# EAGLE design digital_supply (EAGLE 6.1)
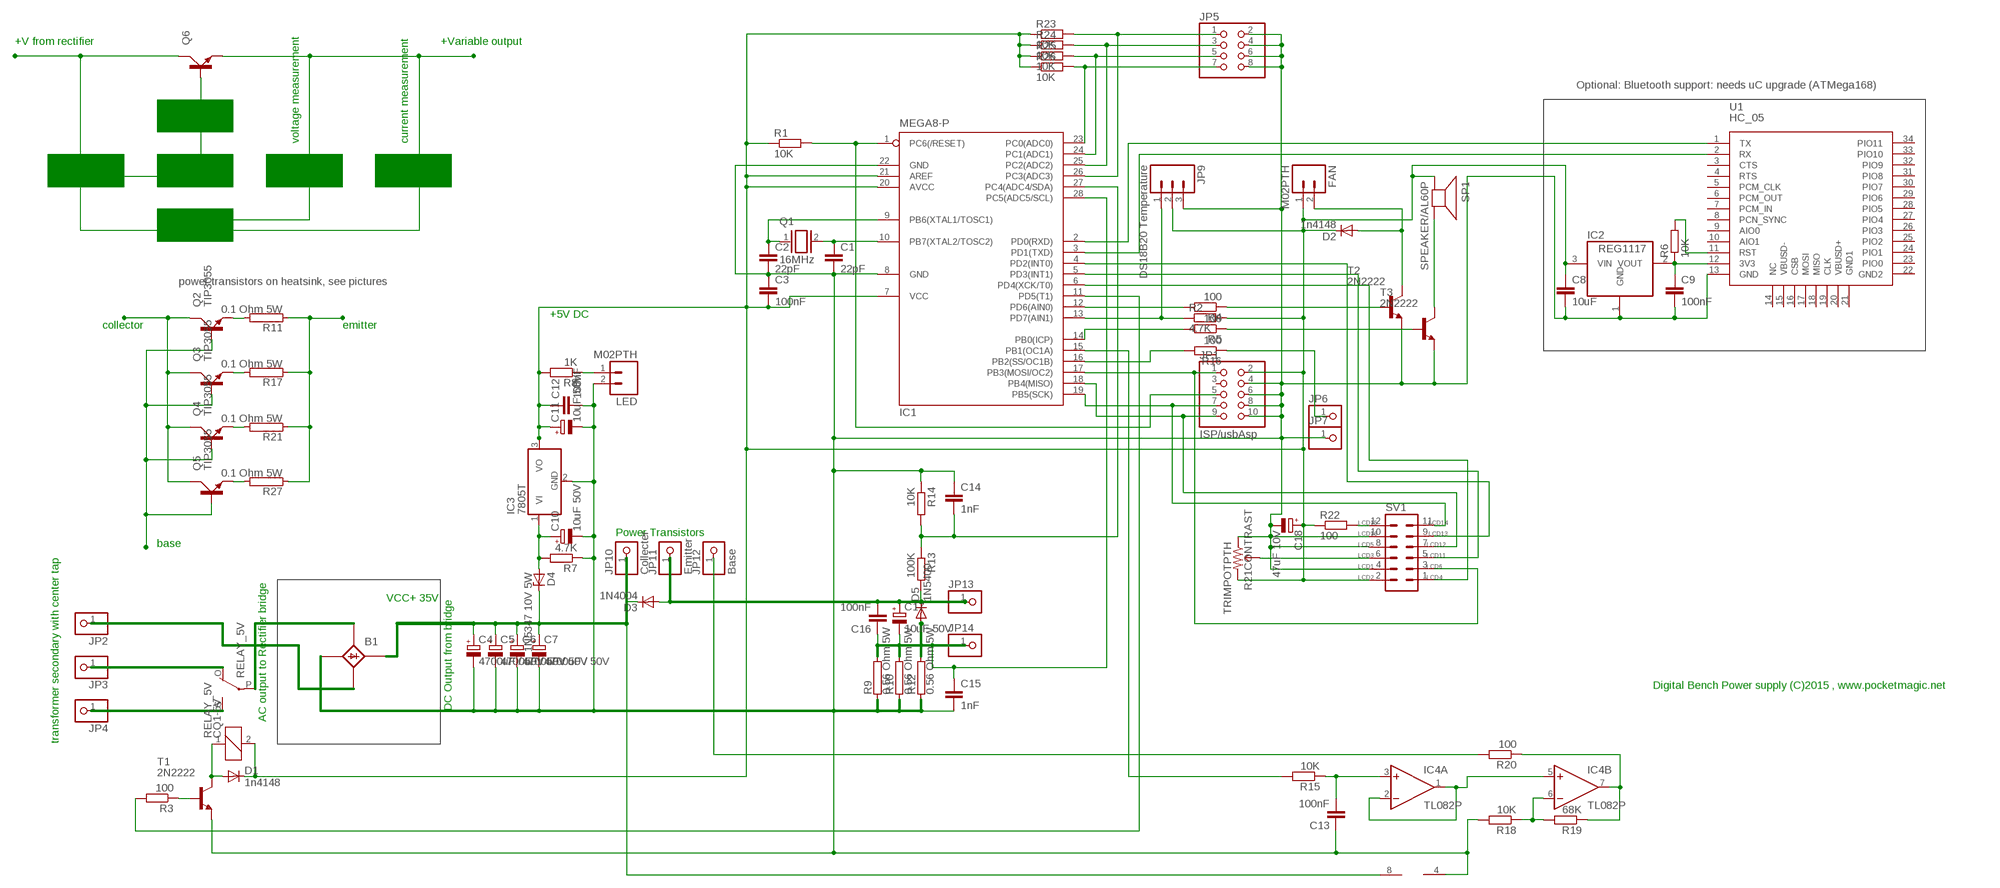
[diagram p0: schematic, sheet 1]

## Parts
B1  B25A-  [B25A-]
C1  22pF  C-EU025-024X044  [C025-024X044]
C2  22pF  C-EU025-024X044  [C025-024X044]
C3  100nF  C-EU025-024X044  [C025-024X044]
C4  4700uF / 50V  CPOL-EUE7.5-18  [E7,5-18]
C5  4700uF / 50V  CPOL-EUE7.5-18  [E7,5-18]
C6  4700uF / 50V  CPOL-EUE7.5-18  [E7,5-18]
C7  4700uF / 50V  CPOL-EUE7.5-18  [E7,5-18]
C8  10uF  C-EUC0805  [C0805]
C9  100nF  C-EUC0805  [C0805]
C10  10uF 50V  CPOL-EUE2-5  [E2-5]
C11  10uF 50V  CPOL-EUE2-5  [E2-5]
C12  100nF  C-EU025-024X044  [C025-024X044]
C13  100nF  C-EU025-024X044  [C025-024X044]
C14  1nF  C-EU025-024X044  [C025-024X044]
C15  1nF  C-EU025-024X044  [C025-024X044]
C16  100nF  C-EU025-024X044  [C025-024X044]
C17  10uF 50V  CPOL-EUE2-5  [E2-5]
C18  47uF 10V  CPOL-EUE2-5  [E2-5]
D1  1n4148  DIODE-D-5  [D-5]
D2  1n4148  DIODE-D-5  [D-5]
D3  1N4004  [DO41-10]
D4  1N5347 10V 5W  ZENER-DIODEDO34-7  [DO34Z7]
D5  1N5400  [DO201-15]
FAN  M02PTH  [1X02]
IC1  MEGA8-P  [DIL28-3]
IC2  REG1117  [SOT223]
IC3  7805T  [TO220H]
IC4  TL082P  [DIL08]
JP1  ISP/usbAsp  PINHD-2X5  [2X05]
JP2  PINHD-1X1  [1X01]
JP3  PINHD-1X1  [1X01]
JP4  PINHD-1X1  [1X01]
JP5  PINHD-2X4  [2X04]
JP6  PINHD-1X1  [1X01]
JP7  PINHD-1X1  [1X01]
JP9  DS18B20 Temperature  M03PTH  [1X03]
JP10  Collecter  PINHD-1X1  [1X01]
JP11  Emitter  PINHD-1X1  [1X01]
JP12  Base  PINHD-1X1  [1X01]
JP13  PINHD-1X1  [1X01]
JP14  PINHD-1X1  [1X01]
LED  M02PTH  [1X02]
Q1  16MHz  XTAL/S  [QS]
Q2  TIP3055  [TOP3AV]
Q3  TIP3055  [TOP3AV]
Q4  TIP3055  [TOP3AV]
Q5  TIP3055  [TOP3AV]
Q6  TIP3055  [TOP3AV]
R1  10K  R-EU_0204/7  [0204/7]
R2  4.7K  R-EU_0204/7  [0204/7]
R3  100  R-EU_0204/7  [0204/7]
R4  100  R-EU_0204/7  [0204/7]
R5  100  R-EU_0204/7  [0204/7]
R6  10K  R-EU_M0805  [M0805]
R7  4.7K  R-EU_0204/7  [0204/7]
R8  1K  R-EU_0204/7  [0204/7]
R9  0.56 Ohm 5W  RAC05  [AC05]
R10  0.56 Ohm 5W  RAC05  [AC05]
R11  0.1 Ohm 5W  RAC05  [AC05]
R12  0.56 Ohm 5W  RAC05  [AC05]
R13  100K  R-EU_0204/7  [0204/7]
R14  10K  R-EU_0204/7  [0204/7]
R15  10K  R-EU_0204/7  [0204/7]
R16  100  R-EU_0204/7  [0204/7]
R17  0.1 Ohm 5W  RAC05  [AC05]
R18  10K  R-EU_0204/7  [0204/7]
R19  68K  R-EU_0204/7  [0204/7]
R20  100  R-EU_0204/7  [0204/7]
R21  0.1 Ohm 5W  RAC05  [AC05]
R21CONTRAST  TRIMPOTPTH  [TRIM_POT_PTH]
R22  100  R-EU_0204/7  [0204/7]
R23  10K  R-EU_0204/7  [0204/7]
R24  10K  R-EU_0204/7  [0204/7]
R25  10K  R-EU_0204/7  [0204/7]
R26  10K  R-EU_0204/7  [0204/7]
R27  0.1 Ohm 5W  RAC05  [AC05]
RELAY_5V  CQ1-5V  G5LE  [G5LE]
SP1  SPEAKER/AL60P  [AL60P]
SV1  MA06-2  [MA06-2]
T1  2N2222  [TO92-EBC-OVAL]
T2  2N2222  [TO92-EBC-OVAL]
T3  2N2222  [TO92-EBC-OVAL]
U1  HC_05  [BLUETOOTH_SMD]

## Nets
N$1: C1.1 IC1.10(PB7(XTAL2/TOSC2)) Q1.2
N$2: C2.1 IC1.9(PB6(XTAL1/TOSC1)) Q1.1
N$3: B1.-1(-) C1.2 C2.2 C3.1 C4.- C5.- C6.- C7.- C8.2 C9.2 C10.- C11.- C12.2 C13.1 C14.1 C15.2 C18.- IC1.8(GND) IC1.22(GND) IC2.1(GND) IC3.2(GND) IC4.4(P:V-) JP1.4 JP1.6 JP1.8 JP1.10 JP5.2 JP5.4 JP5.6 JP5.8 JP7.1 JP9.3 LED.2 R7.1 R9.1 R10.1 R12.1 R14.1 R18.2 R21CONTRAST.1(CCW) SV1.4 SV1.8 SV1.10 T1.E T2.E T3.E U1.13(GND)
N$4: LED.1 R8.1
N$5: IC1.1(PC6(/RESET)) JP1.5 R1.2
N$6: IC1.17(PB3(MOSI/OC2)) JP1.1 SV1.3
N$7: IC1.18(PB4(MISO)) JP1.9 SV1.7
N$8: IC1.4(PD2(INT0)) SV1.9
N$9: IC1.14(PB0(ICP)) R5.2
N$10: IC1.13(PD7(AIN1)) JP9.1 R2.1
N$11: JP3.1 RELAY_5V.O(2:O)
N$12: JP4.1 RELAY_5V.S(2:S)
N$13: B1.AC2-(AC2) JP2.1
N$14: B1.AC1-(AC1) RELAY_5V.P(2:P)
N$15: D1.A RELAY_5V.1 T1.C
N$16: B1.+1(+) C4.+ C5.+ C6.+ C7.+ D3.C D4.C IC4.8(P:V+) JP10.1
N$18: R3.1 T1.B
N$19: IC1.11(PD5(T1)) R3.2
N$20: Q6.C
N$21: Q6.B
N$25: Q6.E
N$26: IC1.12(PD6(AIN0)) R4.2
N$27: C15.1 C16.1 C17.- D5.A IC1.28(PC5(ADC5/SCL)) JP14.1 R9.2 R10.2 R12.2
N$28: IC1.15(PB1(OC1A)) R15.2
N$29: C14.2 IC1.27(PC4(ADC4/SDA)) R13.1 R14.2
N$30: R4.1 T2.B
N$31: D2.A FAN.2 T2.C
N$32: IC1.16(PB2(SS/OC1B)) R16.2
N$33: R5.1 T3.B
N$34: SP1.2(-) T3.C
N$35: C16.2 C17.+ D3.A D5.C JP11.1 JP13.1 R13.2
N$36: IC1.2(PD0(RXD)) U1.1(TX)
N$37: IC1.3(PD1(TXD)) U1.2(RX)
N$38: C9.1 IC2.2(VOUT) R6.1 U1.12(3V3)
N$39: C10.+ D4.A IC3.1(VI) R7.2
N$40: R6.2 U1.11(RST)
N$43: Q2.E R11.2
N$46: JP6.1 R16.1
N$47: C13.2 IC4.3(A:+IN) R15.1
N$48: IC4.1(A:OUT) IC4.2(A:-IN) IC4.5(B:+IN)
N$49: IC4.6(B:-IN) R18.1 R19.2
N$51: IC4.7(B:OUT) R19.1 R20.1
N$52: JP12.1 R20.2
N$54: IC1.6(PD4(XCK/T0)) SV1.1
N$55: IC1.5(PD3(INT1)) SV1.5
N$56: IC1.19(PB5(SCK)) JP1.7 SV1.11
N$57: R21CONTRAST.2(WIPER) SV1.6
N$58: R22.2 SV1.12
N$59: C3.2 C8.1 C11.+ C12.1 C18.+ D1.C D2.C FAN.1 IC1.7(VCC) IC1.20(AVCC) IC1.21(AREF) IC2.3(VIN) IC3.3(VO) JP1.2 JP9.2 R1.1 R2.2 R8.2 R21CONTRAST.3(CW) R22.1 R23.1 R24.1 R25.1 R26.1 RELAY_5V.2 SP1.1(+) SV1.2
N$60: IC1.26(PC3(ADC3)) JP5.1 R23.2
N$61: IC1.25(PC2(ADC2)) JP5.3 R24.2
N$62: IC1.24(PC1(ADC1)) JP5.5 R25.2
N$63: IC1.23(PC0(ADC0)) JP5.7 R26.2
N$64: Q3.E R17.2
N$65: Q4.E R21.2
N$66: Q5.E R27.2
N$67: R11.1 R17.1 R21.1 R27.1
N$68: Q2.C Q3.C Q4.C Q5.C
N$69: Q2.B Q3.B Q4.B Q5.B
Unconnected: B1.+ B1.- B1.AC1 B1.AC2 JP1.3 U1.3(CTS) U1.4(RTS) U1.5(PCM_CLK) U1.6(PCM_OUT) U1.7(PCM_IN) U1.8(PCN_SYNC) U1.9(AIO0) U1.10(AIO1) U1.14(NC) U1.15(VBUSD-) U1.16(CSB) U1.17(MOSI) U1.18(MISO) U1.19(CLK) U1.20(VBUSD+) U1.21(GND1) U1.22(GND2) U1.23(PIO0) U1.24(PIO1) U1.25(PIO2) U1.26(PIO3) U1.27(PIO4) U1.28(PIO5) U1.29(PIO6) U1.30(PIO7) U1.31(PIO8) U1.32(PIO9) U1.33(PIO10) U1.34(PIO11)

## Notes on the sheet
- +V from rectifier | +Variable output
- Optional: Bluetooth support: needs uC upgrade (ATMega168)
- AMPLIFIER
- voltage measurement | current measurement
- control logic
- atmega8 | DAC | DIVIDER | SHUNT
- ADC
- power transistors on heatsink, see pictures
- +5V DC
- collector | emitter
- LCD15                                  LCD14
- Power Transistors | LCD16                                  LCD13
- base | LCD5                                   LCD12
- LCD3                                   LCD11
- LCD1                                   LCD6
- LCD2                                   LCD4
- VCC+ 35V
- Digital Bench Power supply (C)2015 , www.pocketmagic.net
- DC Output from bridge
- AC output to Rectifier bridge
- transformer secondary with center tap

## Library data of the parts
B1 = rectifier:B25A-: RECTIFIER 25-A bridge
C1-C3 C12-C16 = rcl:C-EU: CAPACITOR, European symbol
C4-C7 C10 C11 C17 C18 = rcl:CPOL-EU: POLARIZED CAPACITOR, European symbol
C8 C9 = resistor:C-EU: CAPACITOR, European symbol
D1 D2 = diode:DIODE-: DIODE
D3 = adafruit:1N4004: DIODE General purpose 1N400x type rectifier (With bigger pads) http://www.ladyada.net/library/pcb/eaglelibrary.html
D4 = diode:ZENER-DIODE: Z-Diode
D5 = diode:1N5400: DIODE standard rectifier, 3 A, 50 V (Motorola)
FAN LED = sparkfun-connectors:M02: Standard 2-pin 0.1" header. Use with - straight break away headers ( PRT-00116) - right angle break away headers (PRT-00553) - swiss pins (PRT-00743) - machine pins (PRT-00117) - female headers (PRT-00115) Molex polarized connector foot print use with: PRT-08233 with associated crimp pins and housings. 2.54_SCREWTERM for use with PRT-10571. 3.5mm Screw Terminal footprints for PRT-08084 5mm Screw Terminal footprints for use with PRT-08433
IC1 = atmel:MEGA8-P: MICROCONTROLLER 8 Kbytes FLASH, 1 kbytes SRAM, 512 bytes EEPROM, USART, 4-channel 10 bit ADC, 2-channel 8 bit ADC Pin compatible with Atmega48, ATMega88, ATMega168 Source: avr.lbr; OC_FARNELL: unknown; OC_NEWARK: unknown
IC2 = burr-brown:REG1117: 800mA and 1A Low Dropout (LDO) Positive Regulator 1.8V, 2.5V, 2.85V, 3.3V, 5V, and Adj; MPN: REG1117; OC_FARNELL: 1097566; OC_NEWARK: 14P6981
IC3 = linear:78*: Positive VOLTAGE REGULATOR Source: http://cache.national.com/ds/LM/LM78L05.pdf http://www.fairchildsemi.com/ds/LM/LM7805.pdf
IC4 = linear:TL082: OP AMP
JP1 = pinhead:PINHD-2X5: PIN HEADER
JP2-JP4 JP6 JP7 JP10-JP14 = adafruit:PINHD-1X1: Pin header 1x1 for 0.1" spacing With round pins
JP5 = adafruit:PINHD-2X4: PIN HEADER
JP9 = sparkfun-connectors:M03: Header 3 Standard 3-pin 0.1" header. Use with straight break away headers (SKU : PRT-00116), right angle break away headers (PRT-00553), swiss pins (PRT-00743), machine pins (PRT-00117), and female headers (PRT-00115). Molex polarized connector foot print use with SKU : PRT-08232 with associated crimp pins and housings.
Q1 = special:XTAL/S: CRYSTAL
Q2-Q6 = transistor-power:TIP3055: NPN TRANSISTOR
R1-R8 R13-R16 R18-R20 R22-R26 = rcl:R-EU_: RESISTOR, European symbol
R9-R12 R17 R21 R27 = resistor-power:R: Power Resitor; OC_FARNELL: unknown; OC_NEWARK: unknown
R21CONTRAST = sparkfun-electromechanical:TRIMPOT: Various small potentiometers for "set-and-forget" applications
RELAY_5V = relay:G5LE: RELAY 1 x switch, 10 A/120 V AC, 8 A/30 V DC, Omron; OC_FARNELL: unknown; OC_NEWARK: unknown
SP1 = adafruit:SPEAKER: SPEAKER Source: Buerklin Added PS12 (for part # PS1240 piezo) http://www.ladyada.net/library/pcb/eaglelibrary.html
SV1 = con-lstb:MA06-2: PIN HEADER; OC_FARNELL: unknown; OC_NEWARK: unknown
T1-T3 = adafruit:2N2222: NPN TRANSISTOR Big oval pads
U1 = bluetooth-hc-05:HC_05: HC-05 Bluetooth Module

## Board
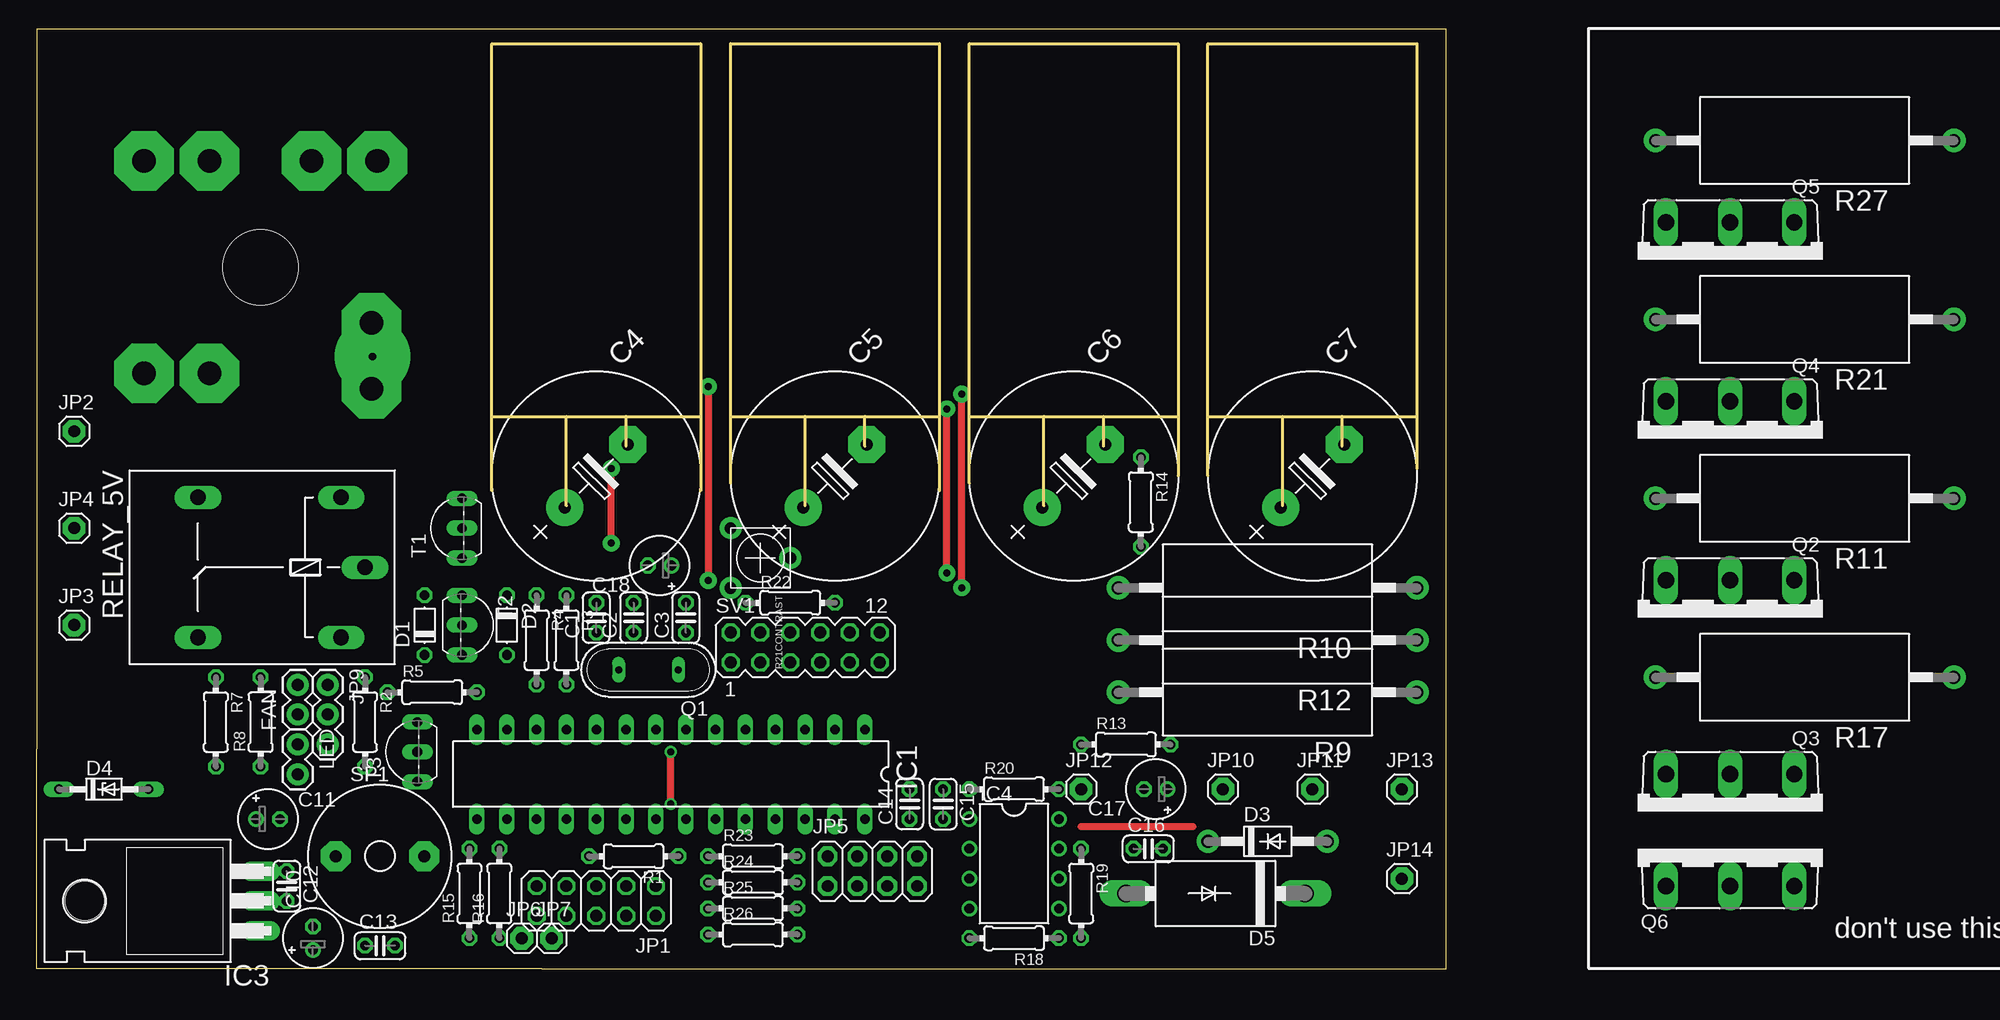
[diagram p1: board, top side]
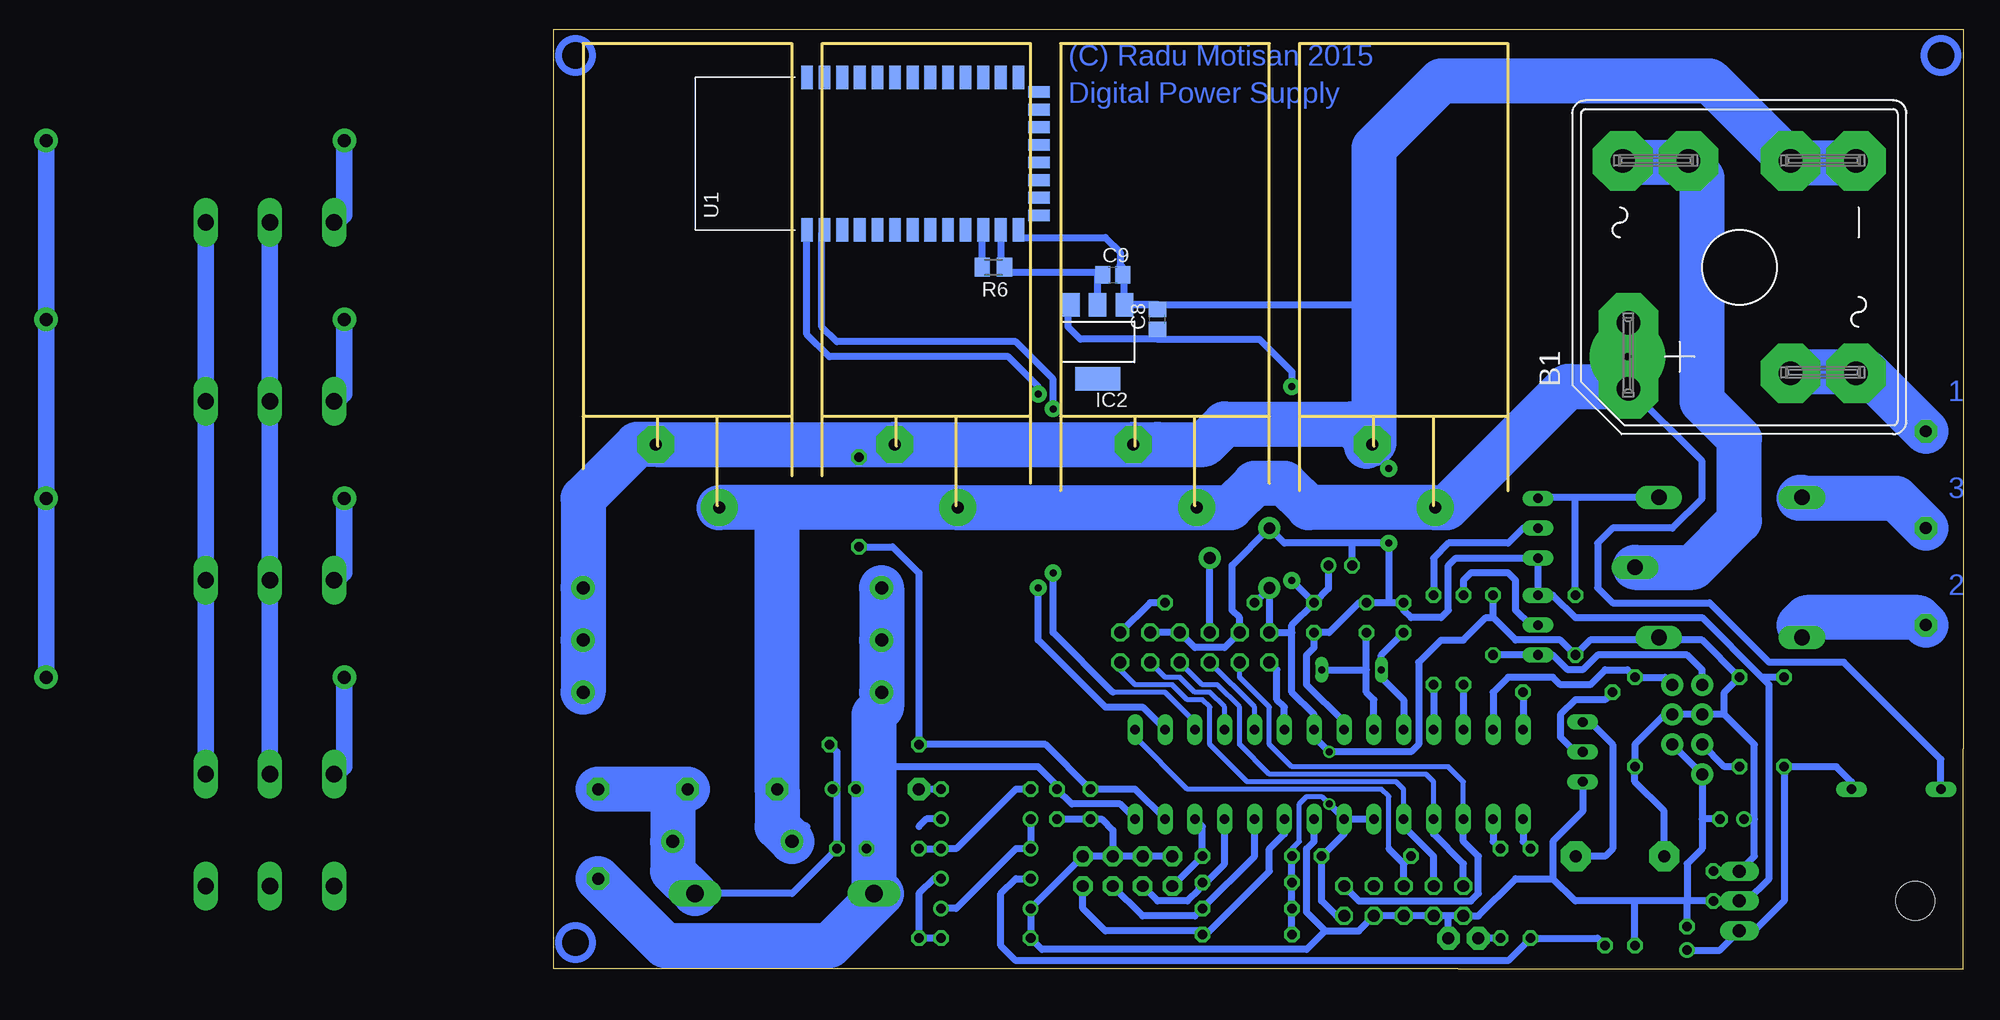
[diagram p2: board, bottom side, seen from below]

Size 120 x 80 mm. Coordinates in mm from the lower left corner, seen from the top.
Outline: 38.73,40.69 38.73,47.04
Outline: 38.73,47.04 38.73,78.79 56.52,78.79 56.52,47.04
Outline: 56.52,47.04 56.52,40.69
Outline: 59.05,41.33 59.05,47.04
Outline: 59.05,47.04 59.05,78.79 76.83,78.79 76.83,47.04
Outline: 76.83,47.04 76.83,40.69
Outline: 79.38,41.33 79.38,47.04
Outline: 79.38,47.04 79.38,78.79 97.16,78.79 97.16,47.04
Outline: 97.16,47.04 97.16,41.96
Outline: 99.69,41.96 99.69,47.04
Outline: 99.69,47.04 99.69,78.79 117.47,78.79 117.47,47.04
Outline: 117.47,47.04 117.47,42.59
Outline: 38.73,47.04 45.09,47.04
Outline: 45.09,47.04 50.16,47.04
Outline: 50.16,47.04 56.52,47.04
Outline: 59.05,47.04 65.41,47.04
Outline: 65.41,47.04 70.48,47.04
Outline: 70.48,47.04 76.83,47.04
Outline: 79.38,47.04 85.72,47.04
Outline: 85.72,47.04 90.81,47.04
Outline: 90.81,47.04 97.16,47.04
Outline: 99.69,47.04 106.05,47.04
Outline: 106.05,47.04 111.12,47.04
Outline: 111.12,47.04 117.47,47.04
Outline: 45.09,39.42 45.09,47.04
Outline: 50.16,44.5 50.16,47.04
Outline: 65.41,39.42 65.41,47.04
Outline: 70.48,44.5 70.48,47.04
Outline: 90.81,44.5 90.81,47.04
Outline: 85.72,39.42 85.72,47.04
Outline: 106.05,39.42 106.05,47.04
Outline: 111.12,44.5 111.12,47.04
Outline: 43,0 120,0 120,80 0,80 0,18.73 0,0 43,0
Copper layers (1*16): Top 0.035mm / dielectric 1.5mm / Bottom 0.035mm
Design rules: minimum track width 10mil, minimum drill 24mil, track to track 8mil, track to pad 8mil, pad to pad 8mil, via to via 8mil, smd to smd 8mil, copper to edge 40mil, drill to drill 8mil, minimum pad ring 10mil, minimum via ring 8mil, stop-mask expansion 4mil, vias tented up to drill 0mil, thermal gap 10mil

### Footprints (pad centres in the part's own frame; a part is rotated, then mirrored left to right if it is on the bottom)
B25A- = drill 2.007 pad 5.08 octagon: + -10.338,9.449; +1 -4.75,9.449; - 9.042,-4.343; -1 9.042,-9.931; AC1 9.042,4.343; AC1- 9.042,9.931; AC2 -9.042,-4.343; AC2- -9.042,-9.931 | hole 6.401: 0,0
C025-024X044 = drill 0.813 octagon: 1 -1.27,0; 2 1.27,0
E7,5-18 = drill 1.016 pad 3.15: + -3.81,0 | drill 1.016 pad 3.15 octagon: - 3.81,0
C0805 = smd 1.3 x 1.5: 1 -0.85,0; 2 0.85,0
E2-5 = drill 0.813 pad 1.27: + -1.016,0 | drill 0.813 pad 1.27 octagon: - 1.016,0
D-5 = drill 0.813 octagon: A 2.54,0; C -2.54,0
DO41-10 = drill 1.118 pad 1.93: A 5.08,0; C -5.08,0
DO34Z7 = drill 0.813 long: A 3.81,0; C -3.81,0
DO201-15 = drill 1.499 long: A 7.62,0; C -7.62,0
1X02 = drill 1.016 pad 1.88: 1 0,0; 2 2.54,0
DIL28-3 = drill 0.813 long: 1 -16.51,-3.81; 2 -13.97,-3.81; 3 -11.43,-3.81; 4 -8.89,-3.81; 5 -6.35,-3.81; 6 -3.81,-3.81; 7 -1.27,-3.81; 8 1.27,-3.81; 9 3.81,-3.81; 10 6.35,-3.81; 11 8.89,-3.81; 12 11.43,-3.81; 13 13.97,-3.81; 14 16.51,-3.81; 15 16.51,3.81; 16 13.97,3.81; 17 11.43,3.81; 18 8.89,3.81; 19 6.35,3.81; 20 3.81,3.81; 21 1.27,3.81; 22 -1.27,3.81; 23 -3.81,3.81; 24 -6.35,3.81; 25 -8.89,3.81; 26 -11.43,3.81; 27 -13.97,3.81; 28 -16.51,3.81
SOT223 = smd 1.499 x 2.007: 1 -2.261,-3.15; 2 0.025,-3.15; 3 2.311,-3.15 | smd 3.81 x 2.007: 4 0,3.15
TO220H = drill 1.118 long: 1 -2.54,-10.16; 2 0,-10.16; 3 2.54,-10.16 | hole 3.302: 0,4.826
DIL08 = drill 0.813 pad 1.27: 1 -3.81,-3.81; 2 -1.27,-3.81; 3 1.27,-3.81; 4 3.81,-3.81; 5 3.81,3.81; 6 1.27,3.81; 7 -1.27,3.81; 8 -3.81,3.81
2X05 = drill 1.016 octagon: 1 -5.08,-1.27; 2 -5.08,1.27; 3 -2.54,-1.27; 4 -2.54,1.27; 5 0,-1.27; 6 0,1.27; 7 2.54,-1.27; 8 2.54,1.27; 9 5.08,-1.27; 10 5.08,1.27
1X01 = drill 1.016 pad 1.93 octagon: 1 0,0
2X04 = drill 1.016 pad 1.676 octagon: 1 -3.81,-1.27; 2 -3.81,1.27; 3 -1.27,-1.27; 4 -1.27,1.27; 5 1.27,-1.27; 6 1.27,1.27; 7 3.81,-1.27; 8 3.81,1.27
1X03 = drill 1.016 pad 1.88: 1 0,0; 2 2.54,0; 3 5.08,0
QS = drill 0.61 long: 1 -2.54,0; 2 2.54,0
TOP3AV = drill 1.397 long: B -5.461,-3.175; C 0,-3.175; E 5.461,-3.175
0204/7 = drill 0.813 octagon: 1 -3.81,0; 2 3.81,0
M0805 = smd 1.3 x 1.6: 1 -0.95,0; 2 0.95,0
AC05 = drill 1.1 pad 2: 1 -12.7,0; 2 12.7,0
TRIM_POT_PTH = drill 1 pad 1.88: 1 -2.54,-2.54; 2 0,2.54; 3 2.54,-2.54
G5LE = drill 1.321 long: 1 -7.493,-5.969; 2 -7.493,5.969; O 4.699,5.969; P -9.525,0; S 4.699,-5.969
AL60P = drill 1.016 pad 2.54 octagon: 1 -3.759,0; 2 3.759,0
MA06-2 = drill 1.016 octagon: 1 -6.35,-1.27; 2 -6.35,1.27; 3 -3.81,-1.27; 4 -3.81,1.27; 5 -1.27,-1.27; 6 -1.27,1.27; 7 1.27,-1.27; 8 1.27,1.27; 9 3.81,-1.27; 10 3.81,1.27; 11 6.35,-1.27; 12 6.35,1.27
TO92-EBC-OVAL = drill 0.813 long: B 0,-1.27; C 2.54,-1.27; E -2.54,-1.27
BLUETOOTH_SMD = smd 2 x 1: 1 -6.35,3.81; 2 -6.35,2.31; 3 -6.35,0.81; 4 -6.35,-0.69; 5 -6.35,-2.19; 6 -6.35,-3.69; 7 -6.35,-5.19; 8 -6.35,-6.69; 9 -6.35,-8.19; 10 -6.35,-9.69; 11 -6.35,-11.19; 12 -6.35,-12.69; 13 -6.35,-14.19; 22 6.65,-14.19; 23 6.65,-12.69; 24 6.65,-11.19; 25 6.65,-9.69; 26 6.65,-8.19; 27 6.65,-6.69; 28 6.65,-5.19; 29 6.65,-3.69; 30 6.65,-2.19; 31 6.65,-0.69; 32 6.65,0.81; 33 6.65,2.31; 34 6.65,3.81 | smd 1 x 1.8: 14 -5.1,-15.94; 15 -3.6,-15.94; 16 -2.1,-15.94; 17 -0.6,-15.94; 18 0.9,-15.94; 19 2.4,-15.94; 20 3.9,-15.94; 21 5.4,-15.94

### Placement (x,y rotation side)
B1  19.05,59.74 90 bottom
C1  47.62,29.9 90 top
C2  50.8,29.9 90 top
C3  55.24,29.9 90 top
C4  47.62,41.96 45 top
C5  67.94,41.96 45 top
C6  88.27,41.96 45 top
C7  108.58,41.96 45 top
C8  68.58,55.3 90 bottom
C9  72.39,59.11 0 bottom
C10  23.5,2.59 90 top
C11  19.68,12.75 0 top
C12  21.27,7.04 270 top
C13  29.21,1.95 0 top
C14  74.3,14.02 90 top
C15  77.15,14.02 270 top
C16  94.61,10.21 0 top
C17  95.25,15.29 180 top
C18  53.02,34.34 180 top
D1  33.02,29.26 90 top
D2  40.01,29.26 270 top
D3  104.78,10.84 0 top
D4  5.71,15.29 0 top
D5  100.33,6.4 180 top
FAN  22.23,21.64 90 top
IC1  53.98,16.56 180 top
IC2  73.66,53.39 180 bottom
IC3  8.89,5.77 90 top
IC4  83.19,8.94 270 top
JP1  47.62,5.77 180 top
JP2  3.17,45.77 0 top
JP3  3.17,29.26 0 top
JP4  3.17,37.52 0 top
JP5  71.12,8.3 0 top
JP6  41.27,2.59 0 top
JP7  43.81,2.59 0 top
JP9  24.77,24.18 270 top
JP10  100.97,15.29 0 top
JP11  108.58,15.29 0 top
JP12  88.9,15.29 0 top
JP13  116.2,15.29 0 top
JP14  116.2,7.67 0 top
LED  22.23,19.1 270 top
Q1  52.07,25.45 180 top
Q2  144.15,29.9 180 top  (outside the outline)
Q3  144.15,13.38 180 top  (outside the outline)
Q4  144.15,45.14 180 top  (outside the outline)
Q5  144.15,60.38 180 top  (outside the outline)
Q6  144.15,10.21 0 top  (outside the outline)
R1  50.8,9.57 180 top
R2  27.94,21.01 270 top
R3  45.09,27.99 270 top
R4  42.55,27.99 270 top
R5  33.66,23.55 0 top
R6  82.55,59.74 180 bottom
R7  15.24,21.01 270 top
R8  19.05,21.01 90 top
R9  104.78,23.55 180 top
R10  104.78,32.44 180 top
R11  150.5,40.05 180 top  (outside the outline)
R12  104.78,27.99 180 top
R13  92.71,19.1 0 top
R14  93.98,39.74 270 top
R15  36.83,6.4 90 top
R16  39.37,6.4 90 top
R17  150.5,24.81 180 top  (outside the outline)
R18  83.19,2.59 180 top
R19  88.9,6.4 270 top
R20  83.19,15.29 0 top
R21  150.5,55.3 180 top  (outside the outline)
R21CONTRAST  61.59,34.98 270 top
R22  64.14,31.16 0 top
R23  60.96,9.57 0 top
R24  60.96,7.35 0 top
R25  60.96,5.13 0 top
R26  60.96,2.91 0 top
R27  150.5,70.53 180 top  (outside the outline)
RELAY_5V  18.41,34.18 180 top
SP1  29.21,9.57 0 top
SV1  65.41,27.35 0 top
T1  34.92,37.52 90 top
T2  37.47,29.26 270 top
T3  31.11,18.47 90 top
U1  94.61,69.27 90 bottom

### Tracks (layer width: path | path; a pad name or v marks a point on that pad's centre or on a via)
N$1
  Bottom 0.61: IC1.10 47.62,22.91 49.53,24.81 Q1.2 49.53,26.72 C1.1
N$2
  Bottom 0.61: IC1.9 50.16,22.91 50.8,23.55 50.8,25.45 | 50.8,25.45 C2.1 | Q1.1 50.8,25.45
N$3  (via drill 0.6 pad 1.42)
  Top 0.61: v48.9,36.24 v48.9,42.59
  Bottom 0.61: 43.81,4.5 JP1.10 41.27,4.5 38.1,7.67 34.92,7.67 | 43.81,4.5 JP1.8 JP1.6 JP1.4 51.44,3.23 54.29,3.23 | 50.8,44.5 50.47,44.5 | 50.47,44.5 50.16,44.5 C4.- 50.47,44.5 | IC2.1 71.4,59.6 | 71.4,59.6 C9.2 | 68.8,44.87 68.58,44.65 | U1.13 80.64,62.92 80.01,62.28 73.03,62.28 71.75,61.01 71.75,59.95 71.4,59.6 | IC2.1 50.8,56.54 50.8,47.04 51.44,46.41 52.07,46.41 | C8.2 68.58,56.56 71.37,56.56 IC2.1 | 48.9,31.16 C1.2 47.62,30.53 46.99,29.9 44.45,29.9 43.81,30.53 43.81,34.34 43.18,34.98 T1.E T2.E 34.92,31.8 33.02,29.9 22.23,29.9 17.14,24.81 | JP9.3 LED.2 22.23,12.75 | IC1.8 52.7,21.01 55.88,24.18 55.88,26.72 55.24,27.35 C3.1 53.98,28.62 51.44,31.16 C2.2 48.9,31.16 | IC1.22 55.24,10.84 55.88,10.21 55.88,4.81 54.29,3.23 | T3.E 32.38,13.38 34.92,10.84 34.92,7.67 | 23.5,5.77 C12.2 IC3.2 18.41,5.77 16.51,7.67 16.51,24.18 17.14,24.81 | 23.5,5.77 27.94,5.77 | 27.94,5.77 33.02,5.77 34.92,7.67 | C13.1 27.94,5.77 | R14.1 92.38,43.23 C6.- | 48.9,31.16 v48.9,36.24 52.07,36.24 | SV1.10 SV1.8 65.41,27.35 62.87,27.35 SV1.4 61.59,29.9 62.23,30.53 62.23,34.34 R21CONTRAST.1 57.78,36.24 52.07,36.24 | v48.9,42.59 50.47,44.5 | JP5.2 JP5.4 JP5.6 | JP5.6 JP5.8 IC4.4 R18.2 78.42,1.64 55.88,1.64 54.29,3.23 | C15.2 C14.1 73.34,12.75 72.39,11.8 JP5.6 | C10.- 23.5,5.77 | C11.- 22.23,12.75 | R7.1 17.14,24.81 | JP7.1 43.81,4.5 | C18.- 52.01,36.18 52.07,36.24 | 22.23,12.75 22.23,10.21 23.5,8.94 23.5,5.77
  Bottom 3.81: 50.16,44.81 C4.- 52.07,46.41 62.87,46.41 64.62,44.65 68.58,44.65 C5.- C6.- C7.- 112.88,44.65 117.47,40.05 R10.1 v117.47,27.99 R9.1 | 50.8,44.5 50.16,45.14 50.16,69.9 44.45,75.61 21.59,75.61 14.61,68.63 9.27,68.63 B1.-1
N$4
  Bottom 0.61: R8.1 20.32,17.2 LED.1
N$5
  Bottom 0.406: 48.9,10.21 48.9,14.66 49.53,15.29 66.04,15.29 70.48,19.73
  Bottom 0.61: 70.48,19.73 IC1.1 | JP1.5 47.62,8.94 | 47.62,8.94 R1.2 | 48.9,10.21 47.62,8.94
N$6
  Bottom 0.406: IC1.17 42.55,15.92 43.81,17.2 57.15,17.2 59.05,19.1 59.05,22.27 61.59,24.81 SV1.3
  Bottom 0.61: JP1.1 51.44,5.77 41.91,5.77 41.27,6.4 41.27,9.57 42.55,10.84 IC1.17
N$7
  Bottom 0.406: IC1.18 45.09,15.92 45.72,16.56 59.05,16.56 61.59,19.1 61.59,22.27 63.5,24.18 64.77,24.18 SV1.7
  Bottom 0.61: JP1.9 42.55,8.94 45.09,11.48 IC1.18
N$8
  Bottom 0.406: IC1.4 62.87,22.27 64.14,23.55 65.41,23.55 66.67,24.81 67.94,24.81 SV1.9
N$9
  Bottom 0.61: R5.2 IC1.14
N$10
  Bottom 0.61: JP9.1 25.4,24.81 R2.1 28.57,25.45 30.48,25.45 31.75,24.18 34.29,24.18 34.92,24.81 38.73,24.81 40.01,23.55 IC1.13 40.01,21.01
N$11
  Bottom 0.61: RELAY_5V.O 13.72,29.01 13.97,29.26
  Bottom 3.81: JP3.1 3.81,29.9 13.34,29.9 13.97,29.26
N$12
  Bottom 3.81: JP4.1 5.71,40.05 13.97,40.05 13.88,40.15 RELAY_5V.S
N$13
  Bottom 3.81: JP2.1 8.26,50.85 9.27,50.85 | 14.61,50.85 9.27,50.85 | 9.27,50.85 B1.AC2-
N$14
  Bottom 3.81: RELAY_5V.P 23.02,34.18 19.05,38.15 19.05,45.14 22.23,48.31 22.23,67.36 23.5,68.63 29.13,68.63 | 29.21,68.63 29.13,68.63 | 29.13,68.63 B1.AC1-
N$15
  Bottom 0.61: RELAY_5V.1 33.02,40.15 | 33.02,40.15 36.1,40.15 T1.C | D1.A 33.02,40.15
N$16  (via drill 0.6 pad 6.45)  (2 unrouted)
  Top 0.61: 88.9,12.11 98.42,12.11
  Bottom 0.61: IC4.8 88.27,12.75 88.9,12.11 | 28.57,49.58 22.23,43.23 22.23,40.05 24.77,37.52 29.84,37.52 31.11,36.24 31.11,32.44 29.84,31.16 21.59,31.16 16.51,26.09 10.16,26.09 1.91,17.83 D4.C | 98.42,12.11 100.33,12.75 100.97,12.11 98.42,12.11
  Bottom 3.81: B1.+1 28.57,54.91 v28.57,52.12 28.57,49.58 33.66,49.58 43.97,39.27 C4.+ 55.73,39.27 57.78,41.33 60.33,41.33 62.38,39.27 C5.+ C6.+ 100.33,39.27 | 100.33,39.27 C7.+ | 100.33,39.27 100.97,38.63 JP10.1 100.97,12.11 D3.C
N$18
  Bottom 0.61: R3.1 45.09,34.98 43.81,36.24 38.73,36.24 37.47,37.52 T1.B
N$19
  Bottom 0.61: R3.2 IC1.11
N$26
  Bottom 0.61: R4.2 IC1.12
N$27  (via drill 0.6 pad 1.42)
  Bottom 0.61: IC1.28 71.75,14.02 75.88,14.02 C15.1 77.15,15.61 78.74,17.2 92.08,17.2 92.71,16.56 93.6,15.67 C17.- | C16.1 92.71,10.21
  Bottom 3.81: JP14.1 110.49,1.95 96.52,1.95 92.08,6.4 D5.A 92.71,10.21 92.71,16.56 92.71,21.64 92.08,22.27 R9.2 R12.2 R10.2
  other vias: 92.08,27.99
N$28
  Bottom 0.61: IC1.15 37.47,10.84 R15.2
N$29
  Bottom 0.61: IC1.27 70.48,15.29 C14.2 78.11,19.1 R13.1 88.9,33.7 91.12,35.93 R14.2
N$30
  Bottom 0.61: T2.B 36.83,29.26 38.1,30.53 38.1,33.07 38.73,33.7 41.91,33.7 42.55,33.07 R4.1
N$31
  Bottom 0.61: D2.A T2.C 34.92,26.72 33.66,25.45 32.38,25.45 31.11,26.72 23.5,26.72 22.23,25.45 FAN.2
N$32
  Bottom 0.61: IC1.16 40.01,10.84 R16.2
N$33
  Bottom 0.61: R5.1 30.48,22.91 33.02,22.91 34.29,21.64 34.29,19.73 33.02,18.47 T3.B
N$34
  Bottom 0.61: T3.C 31.75,21.01 29.84,19.1 29.84,10.21 30.48,9.57 SP1.2
N$35
  Bottom 0.61: 109.86,14.02 JP11.1 | R13.2 95.89,18.47 95.89,15.29 | 95.89,15.29 C16.2 99.69,6.4 D5.C | C17.+ 95.89,15.29
  Bottom 3.81: JP11.1 JP13.1 | 109.86,14.02 D3.A 109.86,8.3 D5.C
N$36  (via drill 0.6 pad 1.42)
  Top 0.61: v78.74,32.44 v78.74,48.94
  Bottom 0.61: v78.74,48.94 78.74,49.58 81.28,52.12 96.52,52.12 98.42,54.03 U1.1 | v78.74,32.44 78.74,27.99 73.03,22.27 69.85,22.27 IC1.2
N$37  (via drill 0.6 pad 1.42)
  Top 0.61: v77.47,33.7 v77.47,47.67
  Bottom 0.406: IC1.3 65.41,21.01 67.94,23.55 72.39,23.55
  Bottom 0.61: v77.47,47.67 77.47,50.22 80.64,53.39 95.89,53.39 97.16,54.66 97.16,62.69 U1.2 | v77.47,33.7 77.47,28.62 72.39,23.55
N$38
  Bottom 0.61: IC2.2 73.69,59.3 | 73.69,59.3 C9.1 | U1.12 81.92,60.06 R6.1 81.16,59.3 73.69,59.3
N$39
  Bottom 0.61: C10.+ 20.7,1.57 IC3.1 17.78,3.23 15.24,5.77 R7.2 10.79,17.2 9.53,15.92 D4.A
N$40
  Bottom 0.61: R6.2 83.5,62.84 U1.11
N$43
  Bottom 1.422: R11.2 137.79,33.7 138.43,33.07 Q2.E
N$46
  Bottom 0.61: R16.1 JP6.1
N$47
  Bottom 0.61: C13.2 31.11,2.59 R15.1 38.73,0.68 80.64,0.68 81.92,1.95 81.92,6.4 80.64,7.67 IC4.3
N$48
  Bottom 0.61: IC4.1 IC4.2 80.64,10.21 85.72,5.13 IC4.5
N$49
  Bottom 0.61: R18.1 R19.2 88.9,6.4 87.63,7.67 IC4.6
N$51
  Bottom 0.61: R19.1 IC4.7 85.72,10.21 80.64,15.29 R20.1
N$52
  Bottom 0.61: R20.2 JP12.1
N$54
  Bottom 0.61: IC1.6 57.78,22.27 58.42,22.91 58.42,25.45 SV1.1
N$55
  Bottom 0.406: IC1.5 60.33,22.27 SV1.5
N$56
  Bottom 0.406: IC1.19 47.62,15.29 48.26,15.92 60.96,15.92 64.14,19.1 64.14,22.27 64.77,22.91 66.04,22.91 67.31,24.18 70.48,24.18 71.75,25.45 SV1.11
  Bottom 0.61: JP1.7 45.09,9.57 47.62,12.11 IC1.19
N$57
  Bottom 0.61: SV1.6 R21CONTRAST.2
N$58
  Bottom 0.61: R22.2 69.22,31.16 SV1.12
N$59  (via drill 0.6, 0.6 pad 1.42)
  Top 0.61: v57.15,49.58 v57.15,33.07 | v53.98,14.02 v53.98,18.47
  Bottom 0.406: v53.98,14.02 54.61,14.66 55.88,14.66 56.52,14.02 56.52,10.84 57.15,10.21 R23.1
  Bottom 0.61: IC1.21 IC1.20 | JP1.2 53.34,4.5 54.61,5.77 R1.1 52.7,11.48 IC1.21 | 68.58,53.62 75.16,53.62 76.2,54.66 76.2,56.31 IC2.3 | C8.1 68.58,53.62 | 26.04,27.99 22.23,27.99 R8.2 20.32,23.55 20.32,21.64 | 26.04,27.99 31.75,27.99 D1.C 34.29,27.99 38.1,27.99 40.01,29.9 | RELAY_5V.2 25.91,28.12 26.04,27.99 | 40.01,29.9 D2.C | 40.01,29.9 40.64,29.9 42.55,27.99 44.45,27.99 46.35,26.09 46.35,19.1 46.99,18.47 v53.98,18.47 55.24,19.73 IC1.7 55.24,21.64 57.15,23.55 57.15,28.62 | 57.15,28.62 57.15,29.26 C3.2 | SP1.1 25.45,13.44 27.94,15.92 R2.2 27.94,19.1 25.4,21.64 JP9.2 FAN.1 20.32,21.64 | IC1.21 v53.98,14.02 | C3.2 v57.15,33.07 | 57.15,28.62 SV1.2 R21CONTRAST.3 R22.1 | 68.58,53.62 59.92,53.62 57.15,50.85 v57.15,49.58 | R26.1 R25.1 R24.1 R23.1 | 17.78,12.75 17.78,9.57 IC3.3 C12.1 | 17.78,12.75 17.78,19.1 20.32,21.64 | C11.+ 17.78,12.75 | C18.+ 54.04,32.37 C3.2
N$60
  Bottom 0.61: IC1.26 64.77,12.11 R23.2 JP5.1
N$61
  Bottom 0.406: R24.2 65.09,7.35
  Bottom 0.61: R24.2 64.45,7.35 62.87,8.94 IC1.25 | 65.09,7.35 65.09,6.72 66.04,5.77 68.58,5.77 JP5.3
N$62
  Bottom 0.61: IC1.24 60.33,9.57 R25.2 65.41,4.5 69.85,4.5 JP5.5
N$63
  Bottom 0.406: R26.2 64.77,3.23
  Bottom 0.61: R26.2 64.45,2.91 59.05,8.3 59.05,10.21 57.78,11.48 IC1.23 | 64.77,3.23 73.03,3.23 74.93,5.13 JP5.7
N$64
  Bottom 1.422: R17.2 137.79,17.2 138.43,16.56 Q3.E
N$65
  Bottom 1.422: R21.2 137.79,48.94 138.43,48.31 Q4.E
N$66
  Bottom 1.422: R27.2 137.79,64.19 138.43,63.55 Q5.E
N$67
  Bottom 1.422: R17.1 R11.1 R21.1 R27.1
N$68
  Bottom 1.422: Q3.C Q2.C Q4.C Q5.C
N$69
  Bottom 1.422: Q3.B Q2.B Q4.B Q5.B
(copper drawn outside any net)
  shapes: Bottom circle x3

### Text on the board
Bottom: (C) Radu Motisan 2015 | Digital Power Supply | 1 | 3 | 2
tPlace: don't use this